# EAGLE design v2 (EAGLE 7.2.0)
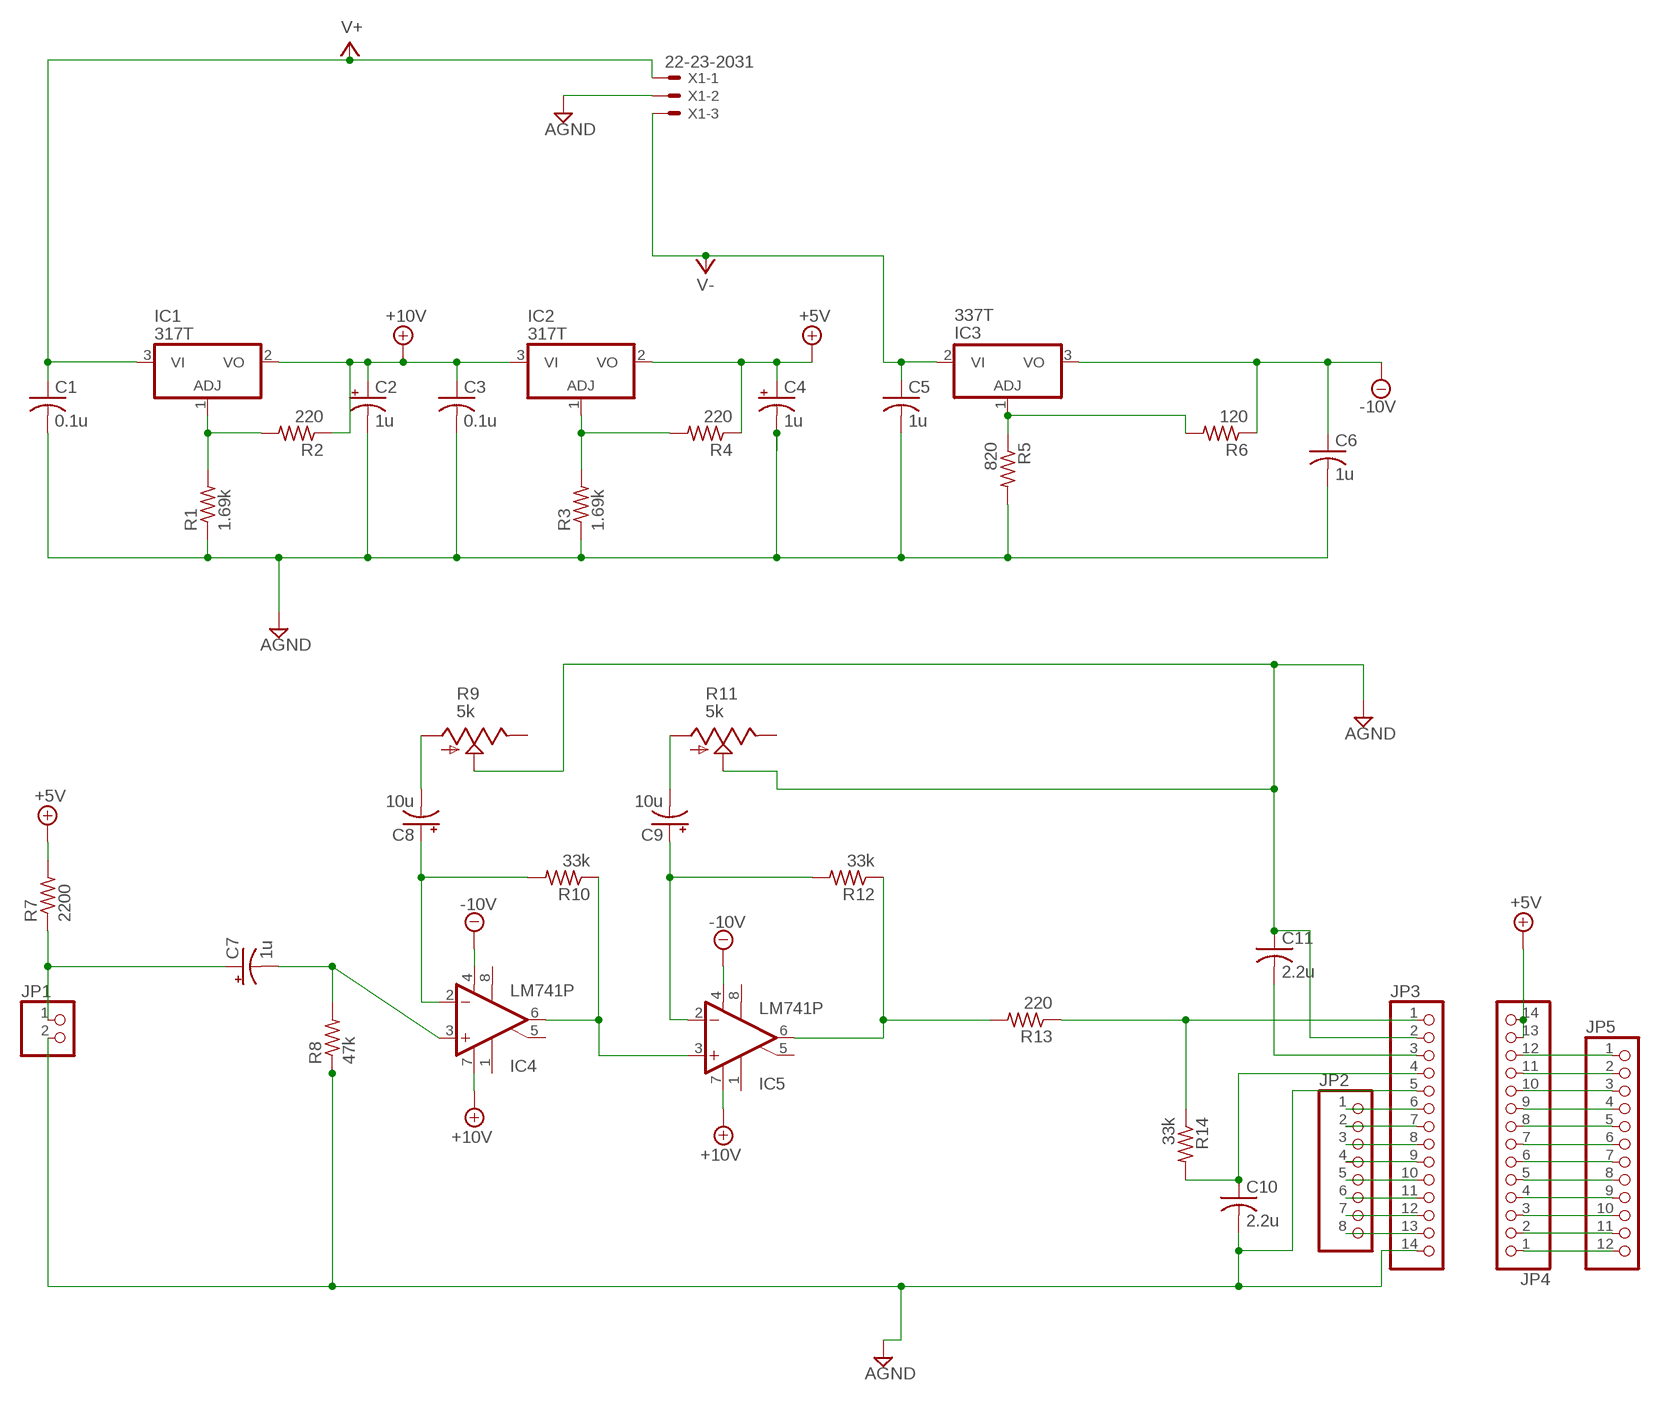
[diagram p0: schematic, sheet 1]

## Parts
C1  0.1u  C-US050-045X075  [C050-045X075]
C2  1u  CPOL-USE2.5-5  [E2,5-5]
C3  0.1u  C-US050-045X075  [C050-045X075]
C4  1u  CPOL-USE2.5-5  [E2,5-5]
C5  1u  C-US050-045X075  [C050-045X075]
C6  1u  C-US050-045X075  [C050-045X075]
C7  1u  CPOL-USE2.5-5  [E2,5-5]
C8  10u  CPOL-USE2.5-5  [E2,5-5]
C9  10u  CPOL-USE2.5-5  [E2,5-5]
C10  2.2u  C-US050-045X075  [C050-045X075]
C11  2.2u  C-US050-045X075  [C050-045X075]
IC1  317T  [TO220H]
IC2  317T  [TO220H]
IC3  337T  [TO220H]
IC4  LM741P  [DIL08]
IC5  LM741P  [DIL08]
JP1  PINHD-1X2  [1X02]
JP2  PINHD-1X8  [1X08]
JP3  PINHD-1X14  [1X14]
JP4  PINHD-1X14  [1X14]
JP5  PINHD-1X12  [1X12]
R1  1.69k  R-US_0207/10  [0207/10]
R2  220  R-US_0207/10  [0207/10]
R3  1.69k  R-US_0207/10  [0207/10]
R4  220  R-US_0207/10  [0207/10]
R5  820  R-US_0207/10  [0207/10]
R6  120  R-US_0207/10  [0207/10]
R7  2200  R-US_0207/10  [0207/10]
R8  47k  R-US_0207/10  [0207/10]
R9  5k  TRIM_US-CA6V  [CA6V]
R10  33k  R-US_0207/10  [0207/10]
R11  5k  TRIM_US-CA6V  [CA6V]
R12  33k  R-US_0207/10  [0207/10]
R13  220  R-US_0207/10  [0207/10]
R14  33k  R-US_0207/10  [0207/10]
X1  22-23-2031  [22-23-2031]

## Nets
+5V: C4.+ IC2.2(VO) JP4.13 JP4.14 R4.1 R7.2
+10V: C2.+ C3.1 IC1.2(VO) IC2.3(VI) IC4.7(V+) IC5.7(V+) R2.1
-10V: C6.1 IC3.3(VO) IC4.4(V-) IC5.4(V-) R6.1
AGND: C1.2 C2.- C3.2 C4.- C5.2 C6.2 C10.2 C11.1 JP1.2 JP3.2 JP3.5 JP3.14 R1.1 R3.1 R5.2 R8.1 R9.S R11.S X1.2
N$1: IC4.6(OUT) IC5.3(+IN) R10.1
N$2: C7.+ JP1.1 R7.1
N$3: C7.- IC4.3(+IN) R8.2
N$4: C8.+ IC4.2(-IN) R10.2
N$5: IC5.6(OUT) R12.1 R13.2
N$6: C9.+ IC5.2(-IN) R12.2
N$7: JP3.1 R13.1 R14.1
N$8: IC1.1(ADJ) R1.2 R2.2
N$9: IC2.1(ADJ) R3.2 R4.2
N$10: IC3.1(ADJ) R5.1 R6.2
N$11: C8.- R9.A
N$14: C9.- R11.A
N$15: C11.2 JP3.3
N$16: C10.1 JP3.4 R14.2
N$18: JP2.8 JP3.13
N$19: JP2.7 JP3.12
N$20: JP2.6 JP3.11
N$21: JP2.5 JP3.10
N$22: JP2.4 JP3.9
N$23: JP2.3 JP3.8
N$24: JP2.2 JP3.7
N$25: JP2.1 JP3.6
N$26: JP4.1 JP5.12
N$27: JP4.2 JP5.11
N$28: JP4.3 JP5.10
N$29: JP4.4 JP5.9
N$30: JP4.5 JP5.8
N$31: JP4.6 JP5.7
N$32: JP4.7 JP5.6
N$33: JP4.8 JP5.5
N$34: JP4.9 JP5.4
N$35: JP4.10 JP5.3
N$36: JP4.11 JP5.2
N$37: JP4.12 JP5.1
V+: C1.1 IC1.3(VI) X1.1
V-: C5.1 IC3.2(VI) X1.3
Unconnected: IC4.1(ON1) IC4.5(ON2) IC4.8(OPT) IC5.1(ON1) IC5.5(ON2) IC5.8(OPT) R9.E R11.E

## Library data of the parts
C1 C3 C5 C6 C10 C11 = rcl:C-US: CAPACITOR, American symbol
C2 C4 C7-C9 = rcl:CPOL-US: POLARIZED CAPACITOR, American symbol
IC1 IC2 = linear:*317: Positive VOLTAGE REGULATOR
IC3 = linear:*337: Negative VOLTAGE REGULATOR
IC4 IC5 = linear:*741: OP AMP
JP1 = pinhead:PINHD-1X2: PIN HEADER
JP2 = pinhead:PINHD-1X8: PIN HEADER
JP3 JP4 = pinhead:PINHD-1X14: PIN HEADER
JP5 = pinhead:PINHD-1X12: PIN HEADER
R1-R8 R10 R12-R14 = resistor:R-US_: RESISTOR, American symbol
R9 R11 = pot:TRIM_US-: POTENTIOMETER
X1 = con-molex:22-23-2031: .100" (2.54mm) Center Header - 3 Pin; MF: MOLEX; MPN: 22-23-2031; OC_FARNELL: 1462950; OC_NEWARK: 30C0862

## Net classes
0 default: clearance 0.205 mm

## Board
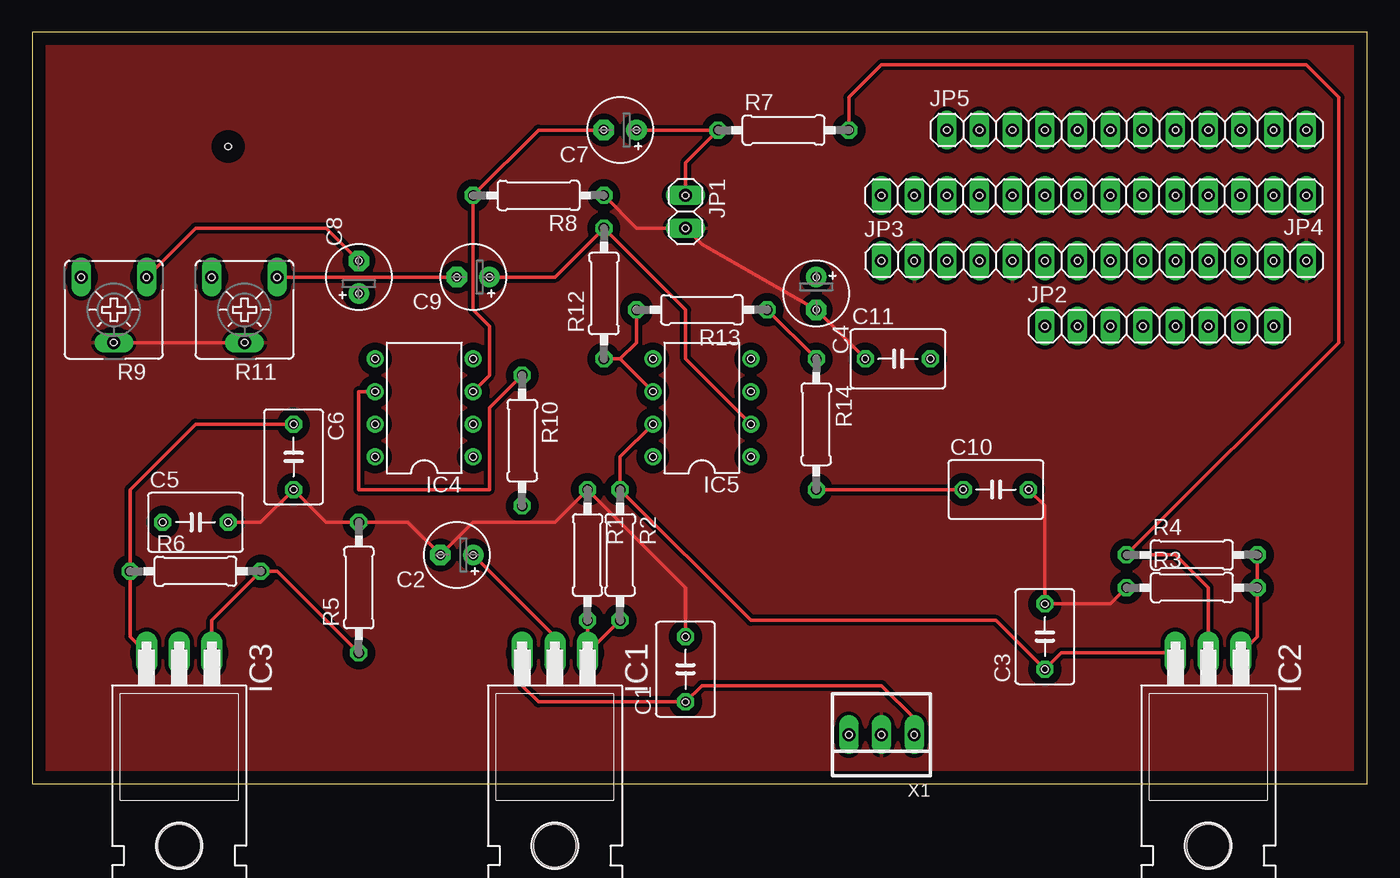
[diagram p1: board, top side]
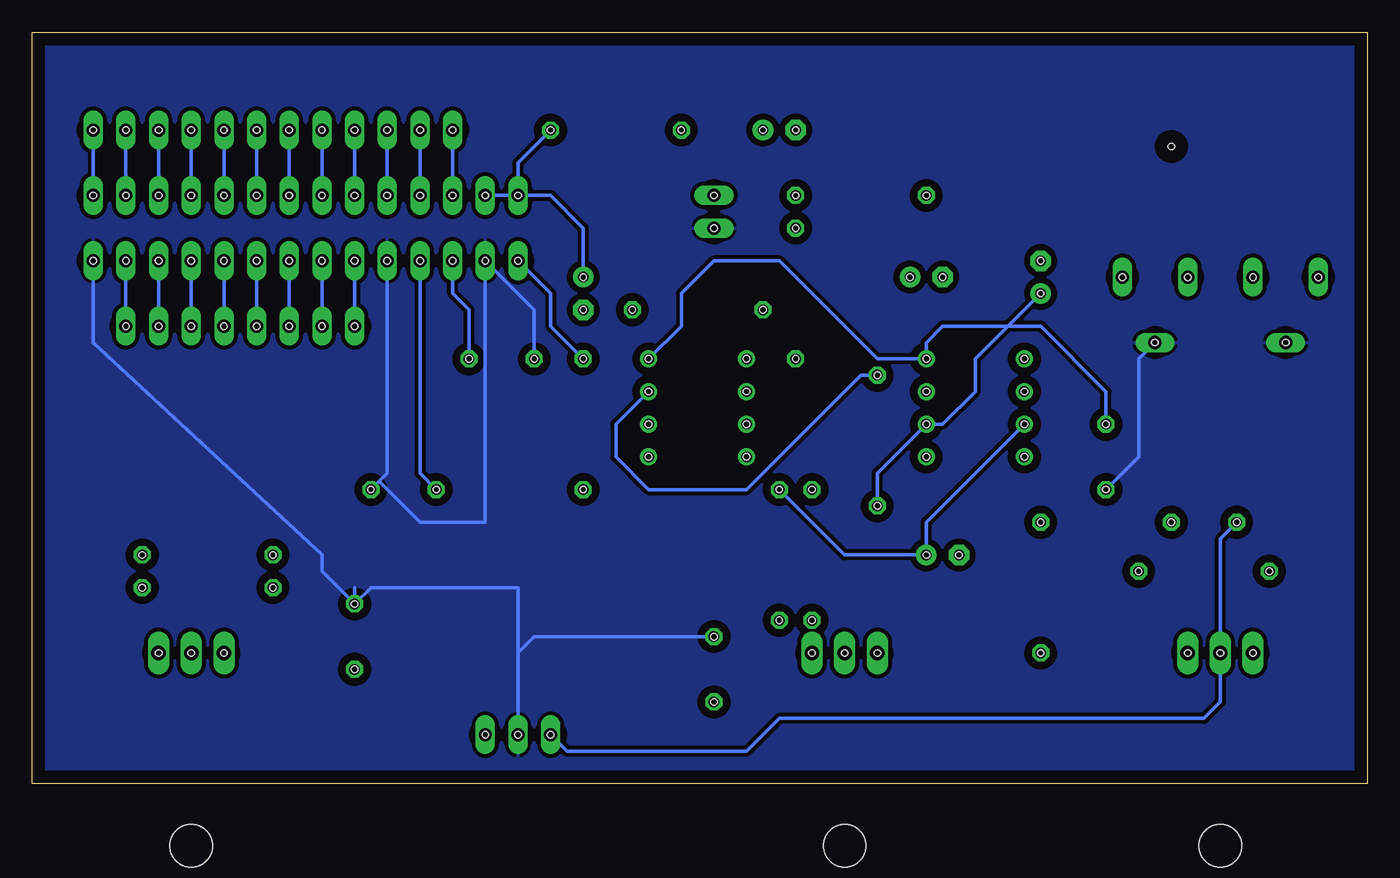
[diagram p2: board, bottom side, seen from below]

Size 103.81 x 58.41 mm. Coordinates in mm from the lower left corner, seen from the top.
Outline: 0,0 103.81,0 103.81,58.41 0,58.41 0,0
Copper layers (1*16): Top 0.035mm / dielectric 1.5mm / Bottom 0.035mm
Design rules "default": minimum track width 10mil, minimum drill 24mil, track to track 8mil, track to pad 8mil, pad to pad 8mil, via to via 8mil, smd to smd 8mil, copper to edge 40mil, drill to drill 8mil, minimum pad ring 10mil, minimum via ring 8mil, stop-mask expansion 4mil, vias tented up to drill 0mil, thermal gap 10mil
Holes 0.51 mm at 44.45,50.8 46.99,50.8 53.34,50.8 63.5,50.8 71.12,50.8 73.66,50.8 76.2,50.8 78.74,50.8 81.28,50.8 83.82,50.8 86.36,50.8 88.9,50.8 91.44,50.8 93.98,50.8 96.52,50.8 99.06,50.8 34.29,45.72 44.45,45.72 50.8,45.72 66.04,45.72 68.58,45.72 71.12,45.72 73.66,45.72 76.2,45.72 78.74,45.72 81.28,45.72 83.82,45.72 86.36,45.72 88.9,45.72 91.44,45.72 93.98,45.72 96.52,45.72 99.06,45.72 44.45,43.18 50.8,43.18 66.04,40.64 68.58,40.64 71.12,40.64 73.66,40.64 76.2,40.64 78.74,40.64 81.28,40.64 83.82,40.64 86.36,40.64 88.9,40.64 91.44,40.64 93.98,40.64 96.52,40.64 99.06,40.64 3.81,39.37 8.89,39.37 13.97,39.37 19.05,39.37 25.4,40.64 25.4,38.1 33.02,39.37 35.56,39.37 60.96,39.37 60.96,36.83 78.74,35.56 81.28,35.56 83.82,35.56 86.36,35.56 88.9,35.56 91.44,35.56 93.98,35.56 96.52,35.56 69.85,33.02 64.77,33.02 60.96,33.02 57.15,36.83 46.99,36.83 44.45,33.02 55.88,33.02 48.26,33.02 48.26,30.48 48.26,27.94 48.26,25.4 55.88,25.4 55.88,27.94 55.88,30.48 55.88,33.02 60.96,22.86 60.96,33.02 72.39,22.86 77.47,22.86 38.1,31.75 38.1,21.59 34.29,33.02 34.29,30.48 34.29,27.94 34.29,25.4 26.67,25.4 26.67,27.94 26.67,30.48 26.67,33.02 20.32,27.94 20.32,22.86 20.32,27.94 20.32,22.86 10.16,20.32 15.24,20.32 7.62,16.51 17.78,16.51 13.97,10.16 11.43,10.16 8.89,10.16 25.4,10.16 25.4,20.32 31.75,17.78 34.29,17.78 38.1,10.16 40.64,10.16 43.18,10.16 43.18,12.7 45.72,12.7 50.8,11.43 50.8,6.35 63.5,3.81 66.04,3.81 68.58,3.81 78.74,8.89 78.74,13.97 78.74,8.89 88.9,10.16 91.44,10.16 93.98,10.16 6.35,34.29 16.51,34.29 85.09,17.78 85.09,15.24 95.25,17.78 95.25,15.24 43.18,22.86 45.72,22.86 15.24,49.53

### Footprints (pad centres in the part's own frame; a part is rotated, then mirrored left to right if it is on the bottom)
C050-045X075 = drill 0.813 octagon: 1 -2.54,0; 2 2.54,0
E2,5-5 = drill 0.813 pad 1.6: + -1.27,0 | drill 0.813 pad 1.6 octagon: - 1.27,0
TO220H = drill 1.118 long: 1 -2.54,-10.16; 2 0,-10.16; 3 2.54,-10.16 | hole 3.302: 0,4.826
DIL08 = drill 0.813 pad 1.27: 1 -3.81,-3.81; 2 -1.27,-3.81; 3 1.27,-3.81; 4 3.81,-3.81; 5 3.81,3.81; 6 1.27,3.81; 7 -1.27,3.81; 8 -3.81,3.81
1X02 = drill 1.016 long: 1 -1.27,0; 2 1.27,0
1X08 = drill 1.016 long: 1 -8.89,0; 2 -6.35,0; 3 -3.81,0; 4 -1.27,0; 5 1.27,0; 6 3.81,0; 7 6.35,0; 8 8.89,0
1X14 = drill 1.016 long: 1 -16.51,0; 2 -13.97,0; 3 -11.43,0; 4 -8.89,0; 5 -6.35,0; 6 -3.81,0; 7 -1.27,0; 8 1.27,0; 9 3.81,0; 10 6.35,0; 11 8.89,0; 12 11.43,0; 13 13.97,0; 14 16.51,0
1X12 = drill 1.016 long: 1 -13.97,0; 2 -11.43,0; 3 -8.89,0; 4 -6.35,0; 5 -3.81,0; 6 -1.27,0; 7 1.27,0; 8 3.81,0; 9 6.35,0; 10 8.89,0; 11 11.43,0; 12 13.97,0
0207/10 = drill 0.813 octagon: 1 -5.08,0; 2 5.08,0
CA6V = drill 1.016 long: A -2.54,-2.54; E 2.54,-2.54; S 0,2.54
22-23-2031 = drill 1 long: 1 -2.54,0; 2 0,0; 3 2.54,0

### Placement (x,y rotation side)
C1  50.8,8.89 90 top
C2  33.02,17.78 180 top
C3  78.74,11.43 90 top
C4  60.96,38.1 270 top
C5  12.7,20.32 0 top
C6  20.32,25.4 270 top
C7  45.72,50.8 180 top
C8  25.4,39.37 90 top
C9  34.29,39.37 180 top
C10  74.93,22.86 0 top
C11  67.31,33.02 0 top
IC1  40.64,0 180 top
IC2  91.44,0 180 top
IC3  11.43,0 180 top
IC4  30.48,29.21 90 top
IC5  52.07,29.21 90 top
JP1  50.8,44.45 270 top
JP2  87.63,35.56 0 top
JP3  82.55,40.64 0 top
JP4  82.55,45.72 180 top
JP5  85.09,50.8 0 top
R1  43.18,17.78 270 top
R2  45.72,17.78 270 top
R3  90.17,15.24 0 top
R4  90.17,17.78 0 top
R5  25.4,15.24 90 top
R6  12.7,16.51 0 top
R7  58.42,50.8 0 top
R8  39.37,45.72 180 top
R9  6.35,36.83 180 top
R10  38.1,26.67 270 top
R11  16.51,36.83 180 top
R12  44.45,38.1 90 top
R13  52.07,36.83 180 top
R14  60.96,27.94 270 top
X1  66.04,3.81 180 top

### Tracks (layer width: path | path; a pad name or v marks a point on that pad's centre or on a via)
+5V
  Top 0.254: IC2.2 91.44,15.24 88.9,17.78 R4.1 101.6,34.29 101.6,53.34 99.06,55.88 66.04,55.88 63.5,53.34 R7.2
  Bottom 0.254: JP4.14 66.04,48.26 R7.2 | JP4.13 JP4.14 | JP4.14 63.5,45.72 60.96,43.18 C4.+
+10V
  Top 0.254: IC2.3 80.01,10.16 C3.1 74.93,12.7 55.88,12.7 R2.1 45.72,25.4 IC5.7 | IC1.2 40.64,11.43 C2.+
  Bottom 0.254: R2.1 40.64,17.78 C2.+ 34.29,20.32 IC4.7
-10V
  Top 0.254: IC3.3 7.62,11.43 R6.1 7.62,22.86 12.7,27.94 C6.1
  Bottom 0.254: C6.1 20.32,30.48 25.4,35.56 33.02,35.56 34.29,34.29 IC4.4 38.1,33.02 45.72,40.64 50.8,40.64 53.34,38.1 53.34,35.56 IC5.4
AGND
  Top 0.254: C10.2 78.74,21.59 C3.2 83.82,13.97 R3.1 | R8.1 46.99,43.18 JP1.2 52.07,41.91 C4.- C11.1 | R9.S R11.S | C5.2 17.78,20.32 C6.2 22.86,20.32 R5.2 29.21,20.32 C2.- 34.29,20.32 40.64,20.32 R1.1 50.8,15.24 C1.2
  Bottom 0.254: C3.2 78.74,15.24 | X1.2 66.04,10.16 | 66.04,10.16 66.04,15.24 77.47,15.24 C3.2 | C1.2 64.77,11.43 66.04,10.16 | C6.2 17.78,25.4 17.78,33.02 R11.S | JP3.14 99.06,34.29 81.28,17.78 81.28,16.51 C3.2 | C11.1 64.77,36.83 JP3.2 68.58,20.32 73.66,20.32 76.83,23.5 | JP3.5 76.2,24.13 76.83,23.5 | 76.83,23.5 C10.2
  pour Top (isolate 0.305): 0,0 0,58.42 104.14,58.42 104.14,57.15 104.14,0
  pour Bottom (isolate 0.305): 0,0 0,58.42 104.14,58.42 104.14,0
N$1
  Top 0.254: IC4.6 25.4,30.48 25.4,22.86 35.56,22.86 35.56,29.21 R10.1
  Bottom 0.254: R10.1 39.37,31.75 48.26,22.86 55.88,22.86 58.42,25.4 58.42,27.94 IC5.3
N$2
  Top 0.254: JP1.1 50.8,48.26 R7.1 C7.+
N$3
  Top 0.254: C7.- 39.37,50.8 R8.2 34.29,36.83 35.56,35.56 35.56,31.75 IC4.3
N$4
  Bottom 0.254: R10.2 38.1,24.13 IC4.2 33.02,27.94 30.48,30.48 30.48,33.02 C8.+
N$5
  Top 0.254: R13.2 46.99,34.29 45.72,33.02 | R12.1 45.72,33.02 | 45.72,33.02 IC5.6
N$6
  Top 0.254: C9.+ 40.64,39.37 R12.2 50.8,36.83 50.8,33.02 IC5.2
N$7
  Top 0.254: R14.1 R13.1
  Bottom 0.254: JP3.1 63.5,38.1 63.5,35.56 R14.1
N$8
  Top 0.254: R2.2 IC1.1 R1.2
N$9
  Top 0.254: IC2.1 95.25,11.43 R3.2 R4.2
N$10
  Top 0.254: IC3.1 13.97,12.7 R6.2 19.05,16.51 R5.1
N$11
  Top 0.254: C8.- 22.86,43.18 12.7,43.18 R9.A
N$14
  Top 0.254: R11.A C9.-
N$15
  Bottom 0.254: C11.2 69.85,36.83 71.12,38.1 JP3.3
N$16
  Top 0.254: R14.2 C10.1
  Bottom 0.254: JP3.4 73.66,24.13 C10.1
N$18
  Bottom 0.254: JP3.13 JP2.8
N$19
  Bottom 0.254: JP3.12 JP2.7
N$20
  Bottom 0.254: JP3.11 JP2.6
N$21
  Bottom 0.254: JP3.10 JP2.5
N$22
  Bottom 0.254: JP3.9 JP2.4
N$23
  Bottom 0.254: JP3.8 JP2.3
N$24
  Bottom 0.254: JP3.7 JP2.2
N$25
  Bottom 0.254: JP3.6 JP2.1
N$26
  Bottom 0.254: JP5.12 JP4.1
N$27
  Bottom 0.254: JP5.11 JP4.2
N$28
  Bottom 0.254: JP5.10 JP4.3
N$29
  Bottom 0.254: JP5.9 JP4.4
N$30
  Bottom 0.254: JP5.8 JP4.5
N$31
  Bottom 0.254: JP5.7 JP4.6
N$32
  Bottom 0.254: JP5.6 JP4.7
N$33
  Bottom 0.254: JP5.5 JP4.8
N$34
  Bottom 0.254: JP5.4 JP4.9
N$35
  Bottom 0.254: JP5.3 JP4.10
N$36
  Bottom 0.254: JP5.2 JP4.11
N$37
  Bottom 0.254: JP5.1 JP4.12
V+
  Top 0.254: X1.1 68.58,5.08 66.04,7.62 52.07,7.62 C1.1 39.37,6.35 38.1,7.62 IC1.3
V-
  Bottom 0.254: X1.3 62.23,2.54 48.26,2.54 45.72,5.08 12.7,5.08 11.43,6.35 IC3.2 11.43,19.05 C5.1